# Altium schematic sheet ASM001-design-5.SchDoc
size 558 x 431 mm
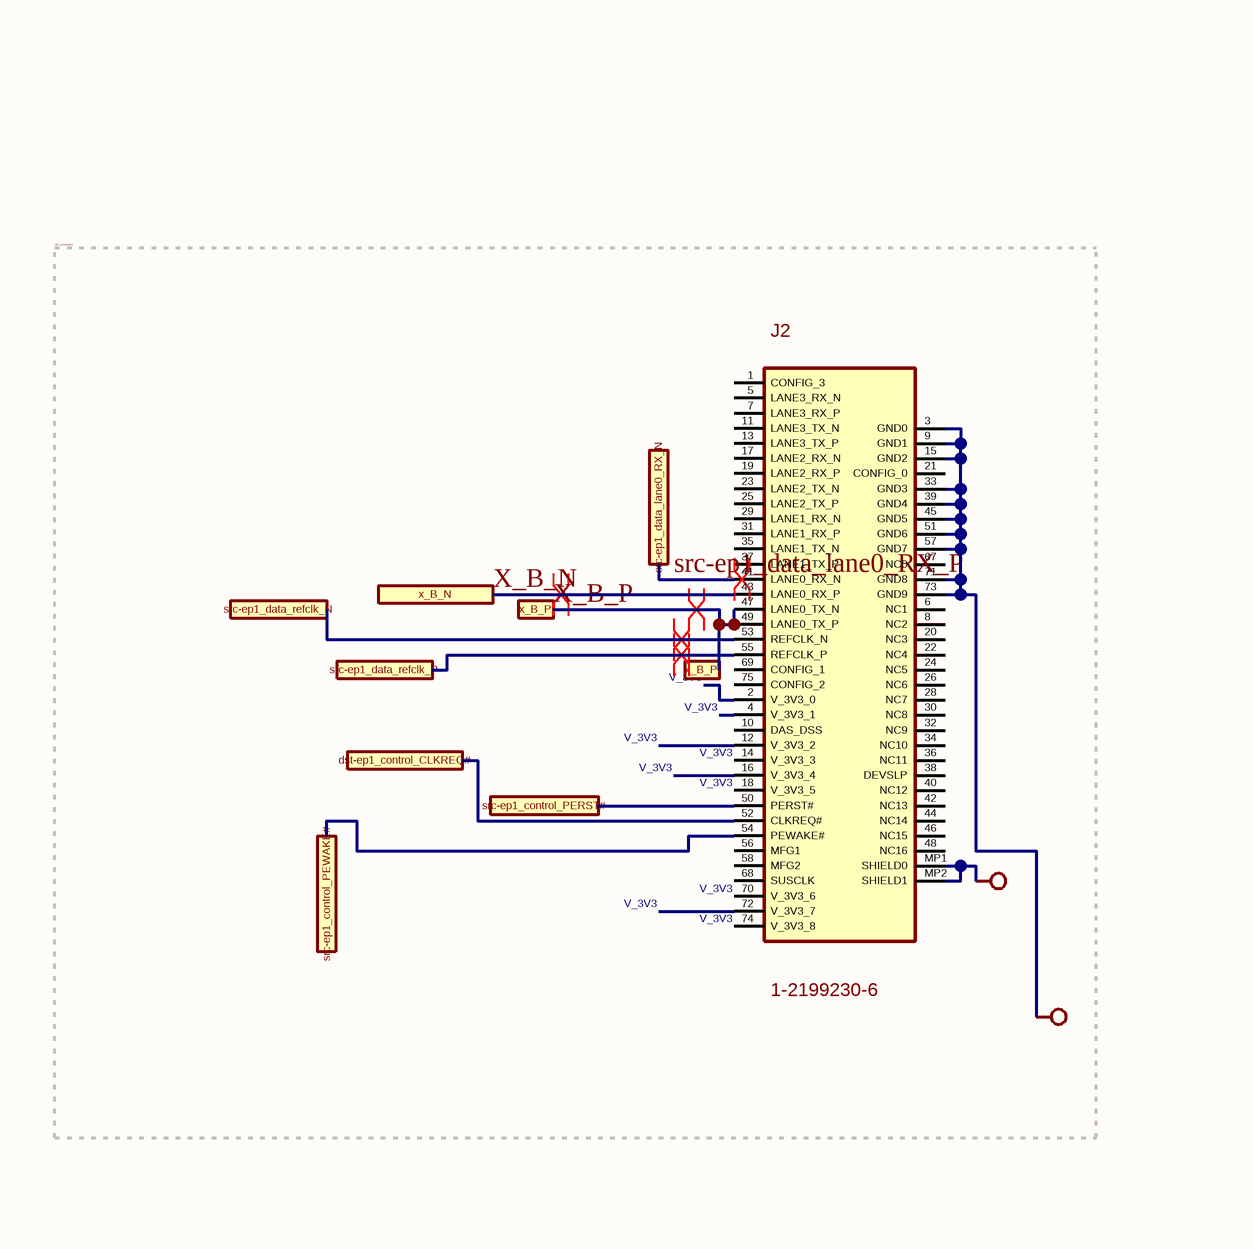
[diagram p0: ASM001-design-5.SchDoc, bottom column 2 of 4]
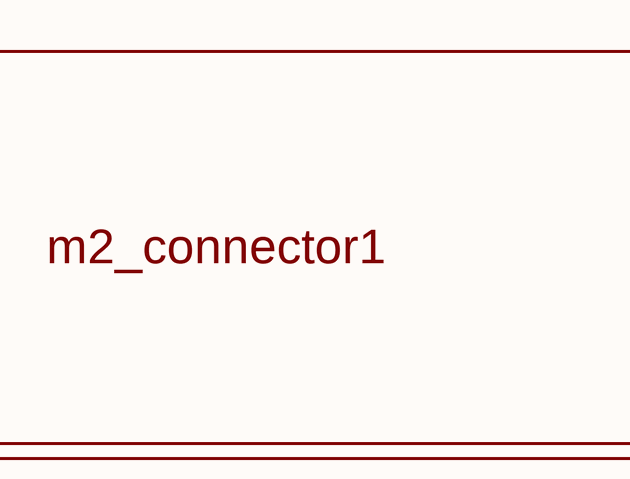
[diagram p1: ASM001-design-5.SchDoc, bottom column 4 of 4]

## Parts
J2  value 1-2199230-6  [LP_1_2199230_6]  (hidden comment: component)

## Blocks framed on the sheet
m2_connector1: J2

## Ports
dst-ep1_control_CLKREQ#, src-ep1_control_PERST#, src-ep1_control_PEWAKE#, src-ep1_data_lane0_RX_N, src-ep1_data_refclk_N, src-ep1_data_refclk_P, x_B_N, x_B_P

## Nets
NetJ2_3: J2.3(GND0) J2.9(GND1) J2.15(GND2) J2.33(GND3) J2.39(GND4) J2.45(GND5) J2.51(GND6) J2.57(GND7) J2.71(GND8) J2.73(GND9) J2.MP1(SHIELD0) J2.MP2(SHIELD1)
dst-ep1_control_CLKREQ#: J2.52(CLKREQ#) ; port dst-ep1_control_CLKREQ#
src-ep1_control_PERST#: J2.50(PERST#) ; port src-ep1_control_PERST#
src-ep1_control_PEWAKE#: J2.54(PEWAKE#) ; port src-ep1_control_PEWAKE#
src-ep1_data_lane0_RX_P: J2.41(LANE0_RX_N) ; port src-ep1_data_lane0_RX_N
src-ep1_data_refclk_N: J2.53(REFCLK_N) ; port src-ep1_data_refclk_N
src-ep1_data_refclk_P: J2.55(REFCLK_P) ; port src-ep1_data_refclk_P
V_3V3: J2.2(V_3V3_0) J2.4(V_3V3_1) J2.12(V_3V3_2) J2.14(V_3V3_3) J2.16(V_3V3_4) J2.18(V_3V3_5) J2.70(V_3V3_6) J2.72(V_3V3_7) J2.74(V_3V3_8)
X_B_N: J2.43(LANE0_RX_P) ; port x_B_N
X_B_P: J2.47(LANE0_TX_N) J2.49(LANE0_TX_P) ; port x_B_P

Not connected (* = marked no-connect by the designer): J2 1(CONFIG_3) 5(LANE3_RX_N) 6(NC1) 7(LANE3_RX_P) 8(NC2) 10(DAS_DSS) 11(LANE3_TX_N) 13(LANE3_TX_P) 17(LANE2_RX_N) 19(LANE2_RX_P) 20(NC3) 21(CONFIG_0) 22(NC4) 23(LANE2_TX_N) 24(NC5) 25(LANE2_TX_P) 26(NC6) 28(NC7) 29(LANE1_RX_N) 30(NC8) 31(LANE1_RX_P) 32(NC9) 34(NC10) 35(LANE1_TX_N) 36(NC11) 37(LANE1_TX_P) 38(DEVSLP) 40(NC12) 42(NC13) 44(NC14) 46(NC15) 48(NC16) 56(MFG1) 58(MFG2) 67(NC0) 68(SUSCLK) 69(CONFIG_1) 75(CONFIG_2)

## Layout directives
differential pair: src-ep1_data_lane0_RX_P, src-ep1_data_refclk_N, src-ep1_data_refclk_P, X_B_N, X_B_P

## Notes on the sheet
- m2_connector1

## Library data of the parts
J2 = component: manufacturer: TE Connectivity; REFERENCE: false; FOOTPRINT: ASM001-design:LP_1_2199230_6; Digi-Key_Part_Number: A118046TR-ND; MPN: 1-2199230-6